# EAGLE design Manchester(c) (EAGLE 7.2.0)
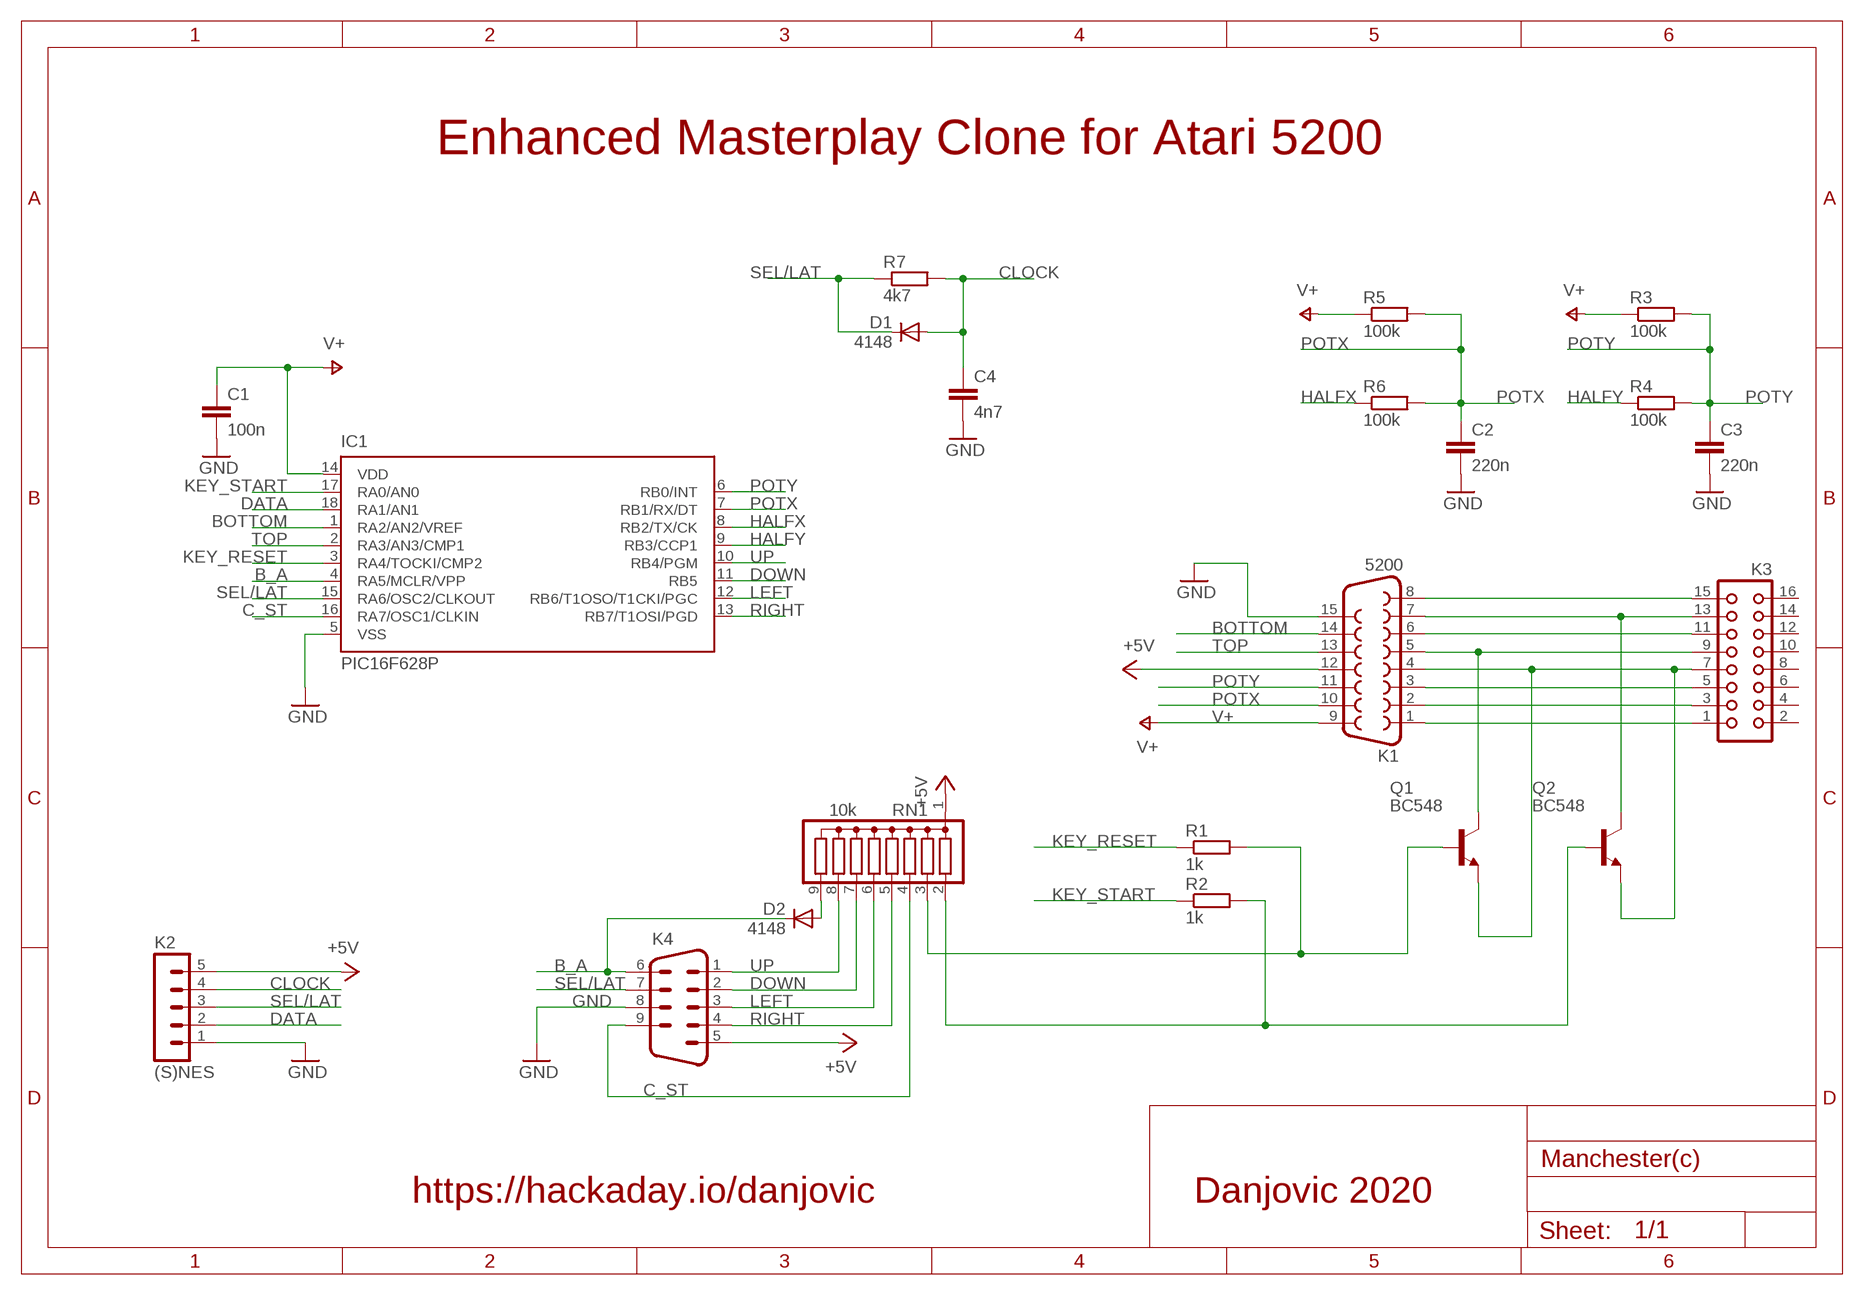
[diagram p0: schematic, sheet 1]

## Parts
C1  100n  C-EU050-024X044  [C050-024X044]
C2  220n  C-EU050-024X044  [C050-024X044]
C3  220n  C-EU050-024X044  [C050-024X044]
C4  4n7  C-EU050-024X044  [C050-024X044]
D1  4148  DIODE-D-5  [D-5]
D2  4148  DIODE-D-5  [D-5]
IC1  PIC16F628P  [DIL18]
K1  5200  F15D  [F15D]
K2  (S)NES  MA05-1  [MA05-1]
K3  CON16L  [CON16L]
K4  M09D  [M09D]
Q1  BC548  [TO92]
Q2  BC548  [TO92]
R1  1k  R-EU_0204/7  [0204/7]
R2  1k  R-EU_0204/7  [0204/7]
R3  100k  R-EU_0204/7  [0204/7]
R4  100k  R-EU_0204/7  [0204/7]
R5  100k  R-EU_0204/7  [0204/7]
R6  100k  R-EU_0204/7  [0204/7]
R7  4k7  R-EU_0204/7  [0204/7]
RN1  10k  G08R  [SIL9]

## Nets
+5V: K1.12 K2.5 K4.5 RN1.1
B_A: D2.C IC1.4(RA5/MCLR/VPP) K4.6
BOTTOM: IC1.1(RA2/AN2/VREF) K1.14
C_ST: IC1.16(RA7/OSC1/CLKIN) K4.9 RN1.4
CLOCK: C4.1 D1.A K2.4 R7.2
COL0: K1.7 K3.13 Q2.3(C)
COL1: K1.6 K3.11
COL2: K1.5 K3.9 Q1.3(C)
COL3: K1.8 K3.15
DATA: IC1.18(RA1/AN1) K2.2
DOWN: IC1.11(RB5) K4.2 RN1.7
GND: C1.2 C2.2 C3.2 C4.2 IC1.5(VSS) K1.15 K2.1 K4.8
HALFX: IC1.8(RB2/TX/CK) R6.1
HALFY: IC1.9(RB3/CCP1) R4.1
KEY_RESET: IC1.3(RA4/TOCKI/CMP2) R1.1
KEY_START: IC1.17(RA0/AN0) R2.1
LEFT: IC1.12(RB6/T1OSO/T1CKI/PGC) K4.3 RN1.6
N$1: Q1.2(B) R1.2 RN1.3
N$2: Q2.2(B) R2.2 RN1.2
N$3: D2.A RN1.9
POTX: C2.1 IC1.7(RB1/RX/DT) K1.10 R5.2 R6.2
POTY: C3.1 IC1.6(RB0/INT) K1.11 R3.2 R4.2
RIGHT: IC1.13(RB7/T1OSI/PGD) K4.4 RN1.5
ROW0: K1.3 K3.5
ROW1: K1.2 K3.3
ROW2: K1.1 K3.1
ROW3: K1.4 K3.7 Q1.1(E) Q2.1(E)
SEL/LAT: D1.C IC1.15(RA6/OSC2/CLKOUT) K2.3 K4.7 R7.1
TOP: IC1.2(RA3/AN3/CMP1) K1.13
UP: IC1.10(RB4/PGM) K4.1 RN1.8
V+: C1.1 IC1.14(VDD) K1.9 R3.1 R5.1
Unconnected: K3.2 K3.4 K3.6 K3.8 K3.10 K3.12 K3.14 K3.16

## Notes on the sheet
- Enhanced Masterplay Clone for Atari 5200
- https://hackaday.io/danjovic | Danjovic 2020

## Library data of the parts
C1-C4 = rcl:C-EU: CAPACITOR, European symbol
D1 D2 = diode:DIODE-: DIODE
IC1 = microchip:PIC16F62*: FLASH-Based 8-Bit CMOS Microcontroller Source: http://ww1.microchip.com/downloads/en/DeviceDoc/40300C.pdf; MF: MICROCHIP; MPN: PIC16F628-04I/P; OC_FARNELL: 9760407; OC_NEWARK: 19C7272
K1 = con-subd:F15: SUB-D; OC_FARNELL: unknown; OC_NEWARK: unknown
K2 = con-lstb:MA05-1: PIN HEADER; OC_FARNELL: unknown; OC_NEWARK: unknown
K3 = con-harting:CON16L: CONNECTOR; OC_FARNELL: unknown; OC_NEWARK: unknown
K4 = con-subd:M09: SUB-D; OC_FARNELL: unknown; OC_NEWARK: unknown
Q1 Q2 = Microdigital:BC548: NPN Transistor
R1-R7 = rcl:R-EU_: RESISTOR, European symbol
RN1 = resistor-sil:G08R: SIL RESISTOR; OC_FARNELL: unknown; OC_NEWARK: unknown

## Board
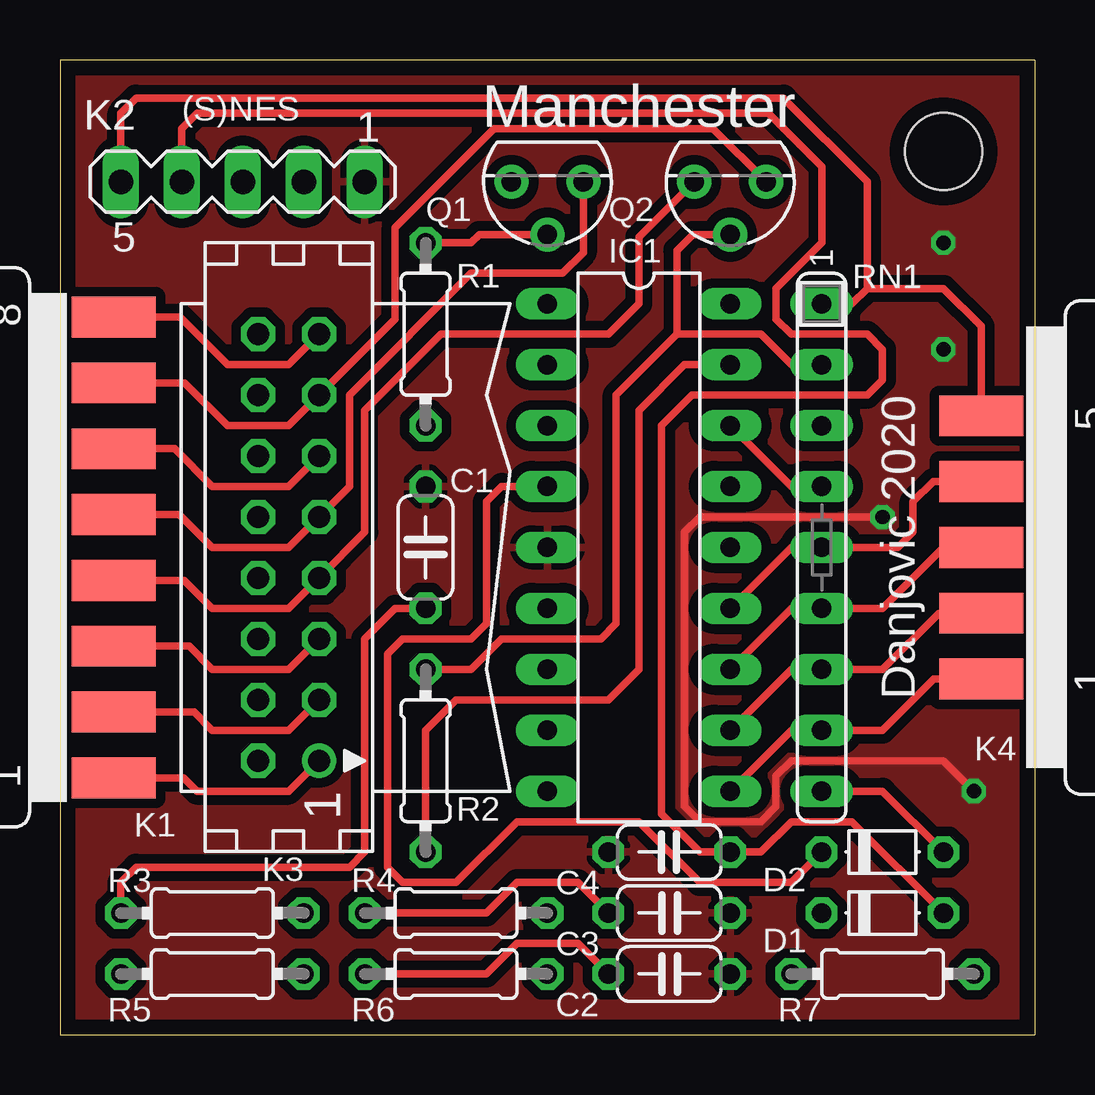
[diagram p1: board, top side]
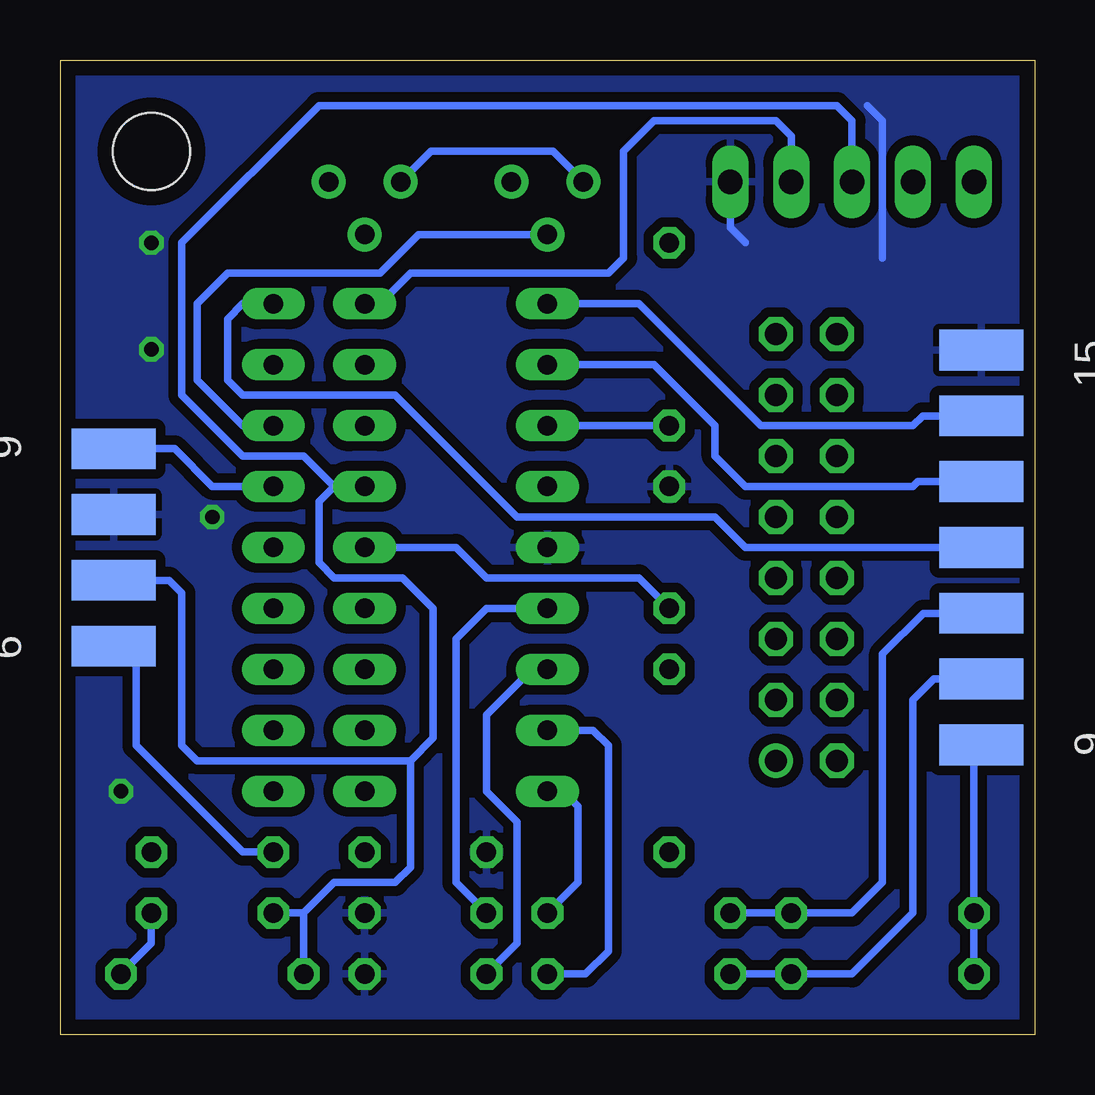
[diagram p2: board, bottom side, seen from below]

Size 40.64 x 40.64 mm. Coordinates in mm from the lower left corner, seen from the top.
Outline: 0,0 40.64,0 40.64,40.64 0,40.64 0,0
Copper layers (1*16): Top 0.035mm / dielectric 1.5mm / Bottom 0.035mm
Design rules "default *": minimum track width 10mil, minimum drill 24mil, track to track 8mil, track to pad 8mil, pad to pad 8mil, via to via 8mil, smd to smd 8mil, copper to edge 25mil, drill to drill 8mil, minimum pad ring 10mil, minimum via ring 8mil, stop-mask expansion 4mil, vias tented up to drill 0mil, thermal gap 10mil
Holes 3.2 mm at 36.83,36.83

### Footprints (pad centres in the part's own frame; a part is rotated, then mirrored left to right if it is on the bottom)
C050-024X044 = drill 0.813 octagon: 1 -2.54,0; 2 2.54,0
D-5 = drill 0.813 octagon: A 2.54,0; C -2.54,0
DIL18 = drill 0.813 long: 1 -10.16,-3.81; 2 -7.62,-3.81; 3 -5.08,-3.81; 4 -2.54,-3.81; 5 0,-3.81; 6 2.54,-3.81; 7 5.08,-3.81; 8 7.62,-3.81; 9 10.16,-3.81; 10 10.16,3.81; 11 7.62,3.81; 12 5.08,3.81; 13 2.54,3.81; 14 0,3.81; 15 -2.54,3.81; 16 -5.08,3.81; 17 -7.62,3.81; 18 -10.16,3.81
F15D = smd 1.7 x 3.5: 1 -9.601,-6.045; 2 -6.858,-6.045; 3 -4.115,-6.045; 4 -1.372,-6.045; 5 1.372,-6.045; 6 4.115,-6.045; 7 6.858,-6.045; 8 9.601,-6.045 | smd 1.7 x 3.5 bottom: 9 -8.23,-6.045; 10 -5.486,-6.045; 11 -2.743,-6.045; 12 0,-6.045; 13 2.743,-6.045; 14 5.486,-6.045; 15 8.23,-6.045
MA05-1 = drill 1.016 long: 1 -5.08,0; 2 -2.54,0; 3 0,0; 4 2.54,0; 5 5.08,0
CON16L = drill 0.914: 1 8.89,1.27 | drill 0.914 octagon: 2 8.89,-1.27; 3 6.35,1.27; 4 6.35,-1.27; 5 3.81,1.27; 6 3.81,-1.27; 7 1.27,1.27; 8 1.27,-1.27; 9 -1.27,1.27; 10 -1.27,-1.27; 11 -3.81,1.27; 12 -3.81,-1.27; 13 -6.35,1.27; 14 -6.35,-1.27; 15 -8.89,1.27; 16 -8.89,-1.27
M09D = smd 1.7 x 3.5: 1 5.486,-6.045; 2 2.743,-6.045; 3 0,-6.045; 4 -2.743,-6.045; 5 -5.486,-6.045 | smd 1.7 x 3.5 bottom: 6 4.115,-6.045; 7 1.372,-6.045; 8 -1.372,-6.045; 9 -4.115,-6.045
TO92 = drill 0.813 pad 1.422: 1 1.5,0; 2 0,2.2; 3 -1.5,0
0204/7 = drill 0.813 octagon: 1 -3.81,0; 2 3.81,0
SIL9 = drill 0.813 long: 1 -10.16,0; 2 -7.62,0; 3 -5.08,0; 4 -2.54,0; 5 0,0; 6 2.54,0; 7 5.08,0; 8 7.62,0; 9 10.16,0

### Placement (x,y rotation side)
C1  15.24,20.32 90 top
C2  25.4,2.54 0 top
C3  25.4,5.08 0 top
C4  25.4,7.62 180 top
D1  34.29,5.08 0 top
D2  34.29,7.62 0 top
IC1  24.13,20.32 270 top
K1  -3.81,20.32 90 top
K2  7.62,35.56 180 top
K3  9.53,20.32 270 top
K4  44.45,20.32 270 top
Q1  20.32,35.56 180 top
Q2  27.94,35.56 180 top
R1  15.24,29.21 90 top
R2  15.24,11.43 90 top
R3  6.35,5.08 0 top
R4  16.51,5.08 180 top
R5  6.35,2.54 0 top
R6  16.51,2.54 180 top
R7  34.29,2.54 0 top
RN1  31.75,20.32 270 top

### Tracks (layer width: path | path; a pad name or v marks a point on that pad's centre or on a via)
+5V
  Top 0.305: K2.5 2.54,38.42 3.17,39.05 30.16,39.05 33.66,35.56 33.66,31.12 | 33.66,31.12 33.02,30.48 RN1.1 | 33.66,31.12 36.83,31.12 38.41,29.54 K4.5
  Bottom 0.305: RN1.1 33.02,30.48 33.66,29.84 33.66,27.3 33.02,26.67 26.67,26.67 21.59,21.59 13.34,21.59 12.06,20.32 K1.12
B_A
  Top 0.305: IC1.4 18.41,22.86 17.78,22.23 17.78,17.14 17.14,16.51 14.29,16.51 13.65,15.88 13.65,6.99 14.29,6.35 16.51,6.35 19.05,8.89 24.13,8.89 26.67,6.35 30.48,6.35 D2.C
  Bottom 0.305: K4.6 37.47,16.21 37.47,12.07 33.02,7.62 D2.C
BOTTOM
  Bottom 0.305: K1.14 4.67,25.81 5.08,25.4 11.43,25.4 16.51,30.48 IC1.1
C_ST
  Top 0.305: RN1.4 30.48,22.86 IC1.16
  Bottom 0.305: K4.9 35.87,24.44 34.29,22.86 RN1.4
CLOCK
  Top 0.305: K2.4 5.08,37.78 5.71,38.42 29.53,38.42 31.75,36.2 31.75,33.02 29.84,31.12 29.84,29.84 30.48,29.21 33.66,29.21 34.29,28.57 34.29,27.3 33.66,26.67 26.35,26.67 25.08,25.4 25.08,9.21 26.67,7.62 C4.1 29.21,7.62 30.48,8.89 33.02,8.89 D1.A
  Bottom 0.305: D1.A 36.83,3.81 R7.2
COL0
  Top 0.305: K1.7 5.21,27.18 6.99,25.4 9.53,25.4 K3.13 13.97,29.84 13.97,33.66 18.1,37.78 27.22,37.78 Q2.3
COL1
  Top 0.305: K1.6 4.78,24.44 6.35,22.86 9.53,22.86 K3.11
COL2
  Top 0.305: K1.5 4.98,21.69 6.35,20.32 9.53,20.32 K3.9 12.06,22.86 12.06,26.67 17.14,31.75 20.95,31.75 21.82,32.62 Q1.3
COL3
  Top 0.305: K1.8 5,29.92 6.99,27.94 9.53,27.94 K3.15
DATA
  Bottom 0.305: K2.2 10.16,37.47 10.79,38.1 15.88,38.1 17.14,36.83 17.14,32.38 17.78,31.75 26.04,31.75 27.3,30.48 IC1.18
DOWN
  Top 0.305: IC1.11 30.48,15.24 RN1.7 34.29,15.24 36.63,17.58 K4.2
GND  (via drill 0.6)
  Top 0.305: v34.29,21.59 26.67,21.59 26.04,20.96 26.04,9.52 26.67,8.89 29.21,8.89 29.84,9.52 29.84,10.8 30.48,11.43 36.83,11.43 v38.1,10.16
  Bottom 0.305: K2.1 12.7,33.66 12.06,33.02 | 6.99,38.73 6.35,38.1 6.35,32.38
  other vias: 36.83,28.57 36.83,33.02
  pour Bottom (isolate 0.406): 0,0 0,40.64 40.64,40.64 40.64,0
  pour Top (isolate 0.406): 0,0 0,40.64 40.64,40.64 40.64,0
HALFX
  Bottom 0.305: R6.1 18.73,2.54 17.78,3.49 17.78,12.07 18.41,12.7 IC1.8
HALFY
  Bottom 0.305: IC1.9 19.68,10.16 19.05,9.52 19.05,6.35 R4.1
KEY_RESET
  Bottom 0.305: R1.1 IC1.3
KEY_START
  Top 0.305: IC1.17 26.04,27.94 24.13,26.04 24.13,15.24 22.86,13.97 16.51,13.97 15.24,12.7 R2.1
LEFT
  Top 0.305: IC1.12 30.48,17.78 RN1.6 34.29,17.78 36.83,20.32 K4.3
N$1
  Top 0.305: Q1.2 17.48,33.36 17.14,33.02 R1.2
  Bottom 0.305: RN1.3 33.02,25.4 34.92,27.3 34.92,30.48 33.66,31.75 27.3,31.75 25.7,33.36 Q1.2
N$2
  Top 0.305: R2.2 17.14,15.24 18.41,16.51 22.54,16.51 23.18,17.14 23.18,26.67 25.72,29.21 | RN1.2 30.48,27.94 29.21,29.21 25.72,29.21 | Q2.2 26.38,33.36 25.72,32.7 25.72,29.21
N$3
  Top 0.305: RN1.9 34.29,10.16 D2.A
POTX
  Top 0.305: R6.2 17.78,2.54 19.05,3.81 21.59,3.81 C2.1
  Bottom 0.305: C2.1 21.59,3.81 21.59,8.89 22.86,10.16 22.86,13.34 20.95,15.24 IC1.7 | K1.10 4.22,14.83 5.08,13.97 5.08,5.08 7.62,2.54 R5.2 R6.2
POTY
  Top 0.305: R4.2 17.78,5.08 19.05,6.35 21.59,6.35 C3.1
  Bottom 0.305: C3.1 24.13,6.35 24.13,16.51 22.86,17.78 IC1.6 | K1.11 4.65,17.58 6.35,15.88 6.35,6.35 7.62,5.08 R3.2 R4.2
RIGHT
  Top 0.305: IC1.13 30.48,20.32 RN1.5 34.92,20.32 35.56,20.96 35.56,22.23 36.4,23.06 K4.4
ROW0
  Top 0.305: K1.3 5.38,16.21 6.35,15.24 9.53,15.24 K3.5
ROW1
  Top 0.305: K1.2 5.59,13.46 6.35,12.7 9.53,12.7 K3.3
ROW2
  Top 0.305: K1.1 5.16,10.72 5.71,10.16 9.53,10.16 K3.1
ROW3
  Top 0.305: K1.4 5.18,18.95 6.35,17.78 9.53,17.78 K3.7 12.7,20.96 12.7,26.04 15.88,29.21 22.86,29.21 24.13,30.48 24.13,33.25 Q2.1
  Bottom 0.305: Q1.1 20.09,36.83 25.17,36.83 Q2.1
SEL/LAT
  Bottom 0.305: K4.7 36.09,18.95 35.56,18.41 35.56,12.07 34.92,11.43 26.04,11.43 | 26.04,11.43 25.08,12.38 25.08,17.78 26.35,19.05 29.21,19.05 29.84,19.69 29.84,22.23 29.21,22.86 | 29.21,22.86 IC1.15 | K2.3 7.62,38.1 8.26,38.73 29.84,38.73 35.56,33.02 35.56,26.67 33.02,24.13 30.48,24.13 29.21,22.86 | 30.48,5.08 R7.1 | 30.48,5.08 29.21,6.35 26.67,6.35 26.04,6.99 26.04,11.43 | D1.C 30.48,5.08
TOP
  Bottom 0.305: K1.13 4.88,23.06 5.08,22.86 12.06,22.86 13.34,24.13 13.34,25.4 15.88,27.94 IC1.2
UP
  Top 0.305: K4.1 36.42,14.83 34.29,12.7 RN1.8 30.48,12.7 IC1.10
V+
  Top 0.305: R3.1 2.54,6.35 3.17,6.99 12.06,6.99 12.7,7.62 12.7,16.51 13.97,17.78 C1.1
  Bottom 0.305: R5.1 R3.1 2.54,11.79 K1.9 | IC1.14 24.13,20.32 22.86,19.05 16.51,19.05 C1.1

### Text on the board
tPlace: Manchester
tNames: (S)NES | Danjovic 2020